# Altium schematic sheet front_pot_plate.SchDoc
size A4; SheetNumber: 1; SheetTotal: 1
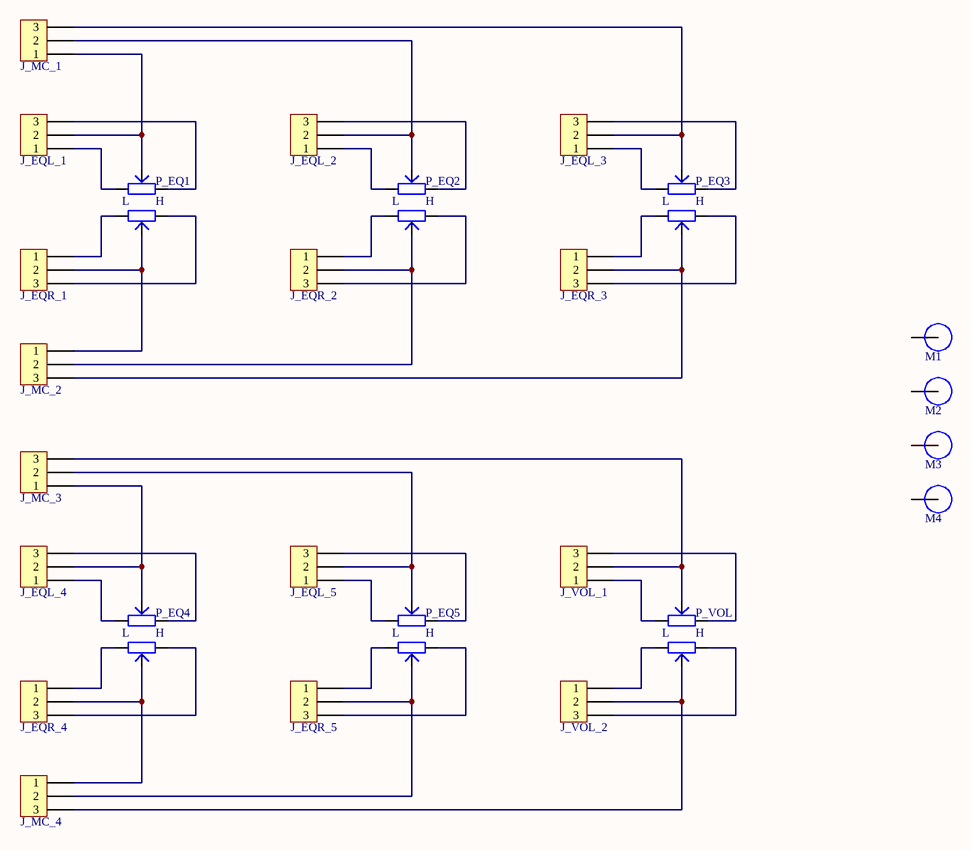
[diagram p0: front_pot_plate.SchDoc]

## Parts
J_EQL_1  Header 1x3  [Header 1x3]  (value not drawn)
J_EQL_2  Header 1x3  [Header 1x3]  (value not drawn)
J_EQL_3  Header 1x3  [Header 1x3]  (value not drawn)
J_EQL_4  Header 1x3  [Header 1x3]  (value not drawn)
J_EQL_5  Header 1x3  [Header 1x3]  (value not drawn)
J_EQR_1  Header 1x3  [Header 1x3]  (value not drawn)
J_EQR_2  Header 1x3  [Header 1x3]  (value not drawn)
J_EQR_3  Header 1x3  [Header 1x3]  (value not drawn)
J_EQR_4  Header 1x3  [Header 1x3]  (value not drawn)
J_EQR_5  Header 1x3  [Header 1x3]  (value not drawn)
J_MC_1  Header 1x3  [Header 1x3]  (value not drawn)
J_MC_2  Header 1x3  [Header 1x3]  (value not drawn)
J_MC_3  Header 1x3  [Header 1x3]  (value not drawn)
J_MC_4  Header 1x3  [Header 1x3]  (value not drawn)
J_VOL_1  Header 1x3  [Header 1x3]  (value not drawn)
J_VOL_2  Header 1x3  [Header 1x3]  (value not drawn)
M1  Screw Hole  [M3 Hole]  (value not drawn)
M2  Screw Hole  [M3 Hole]  (value not drawn)
M3  Screw Hole  [M3 Hole]  (value not drawn)
M4  Screw Hole  [M3 Hole]  (value not drawn)
P_EQ1  stereo_pot  [POT STEREO LOOOOONG]  (value not drawn)
P_EQ2  stereo_pot  [POT STEREO LOOOOONG]  (value not drawn)
P_EQ3  stereo_pot  [POT STEREO LOOOOONG]  (value not drawn)
P_EQ4  stereo_pot  [POT STEREO LOOOOONG]  (value not drawn)
P_EQ5  stereo_pot  [POT STEREO LOOOOONG]  (value not drawn)
P_VOL  stereo_pot  [POT STEREO LOOOOONG]  (value not drawn)

## Nets
NetJ_EQL_1_1: J_EQL_1.1 P_EQ1.2
NetJ_EQL_1_2: J_EQL_1.2 J_MC_1.1 P_EQ1.3
NetJ_EQL_1_3: J_EQL_1.3 P_EQ1.1
NetJ_EQL_2_1: J_EQL_2.1 P_EQ2.2
NetJ_EQL_2_2: J_EQL_2.2 J_MC_1.2 P_EQ2.3
NetJ_EQL_2_3: J_EQL_2.3 P_EQ2.1
NetJ_EQL_3_1: J_EQL_3.1 P_EQ3.2
NetJ_EQL_3_2: J_EQL_3.2 J_MC_1.3 P_EQ3.3
NetJ_EQL_3_3: J_EQL_3.3 P_EQ3.1
NetJ_EQL_4_1: J_EQL_4.1 P_EQ4.2
NetJ_EQL_4_2: J_EQL_4.2 J_MC_3.1 P_EQ4.3
NetJ_EQL_4_3: J_EQL_4.3 P_EQ4.1
NetJ_EQL_5_1: J_EQL_5.1 P_EQ5.2
NetJ_EQL_5_2: J_EQL_5.2 J_MC_3.2 P_EQ5.3
NetJ_EQL_5_3: J_EQL_5.3 P_EQ5.1
NetJ_EQR_1_1: J_EQR_1.1 P_EQ1.5
NetJ_EQR_1_2: J_EQR_1.2 J_MC_2.1 P_EQ1.6
NetJ_EQR_1_3: J_EQR_1.3 P_EQ1.4
NetJ_EQR_2_1: J_EQR_2.1 P_EQ2.5
NetJ_EQR_2_2: J_EQR_2.2 J_MC_2.2 P_EQ2.6
NetJ_EQR_2_3: J_EQR_2.3 P_EQ2.4
NetJ_EQR_3_1: J_EQR_3.1 P_EQ3.5
NetJ_EQR_3_2: J_EQR_3.2 J_MC_2.3 P_EQ3.6
NetJ_EQR_3_3: J_EQR_3.3 P_EQ3.4
NetJ_EQR_4_1: J_EQR_4.1 P_EQ4.5
NetJ_EQR_4_2: J_EQR_4.2 J_MC_4.1 P_EQ4.6
NetJ_EQR_4_3: J_EQR_4.3 P_EQ4.4
NetJ_EQR_5_1: J_EQR_5.1 P_EQ5.5
NetJ_EQR_5_2: J_EQR_5.2 J_MC_4.2 P_EQ5.6
NetJ_EQR_5_3: J_EQR_5.3 P_EQ5.4
NetJ_MC_3_3: J_MC_3.3 J_VOL_1.2 P_VOL.3
NetJ_MC_4_3: J_MC_4.3 J_VOL_2.2 P_VOL.6
NetJ_VOL_1_1: J_VOL_1.1 P_VOL.2
NetJ_VOL_1_3: J_VOL_1.3 P_VOL.1
NetJ_VOL_2_1: J_VOL_2.1 P_VOL.5
NetJ_VOL_2_3: J_VOL_2.3 P_VOL.4

Not connected (* = marked no-connect by the designer): M1 1; M2 1; M3 1; M4 1

## Notes on the sheet
- (in symbol stereo_pot) L; H